# EAGLE design HCM6352 v10 (EAGLE 6.2)
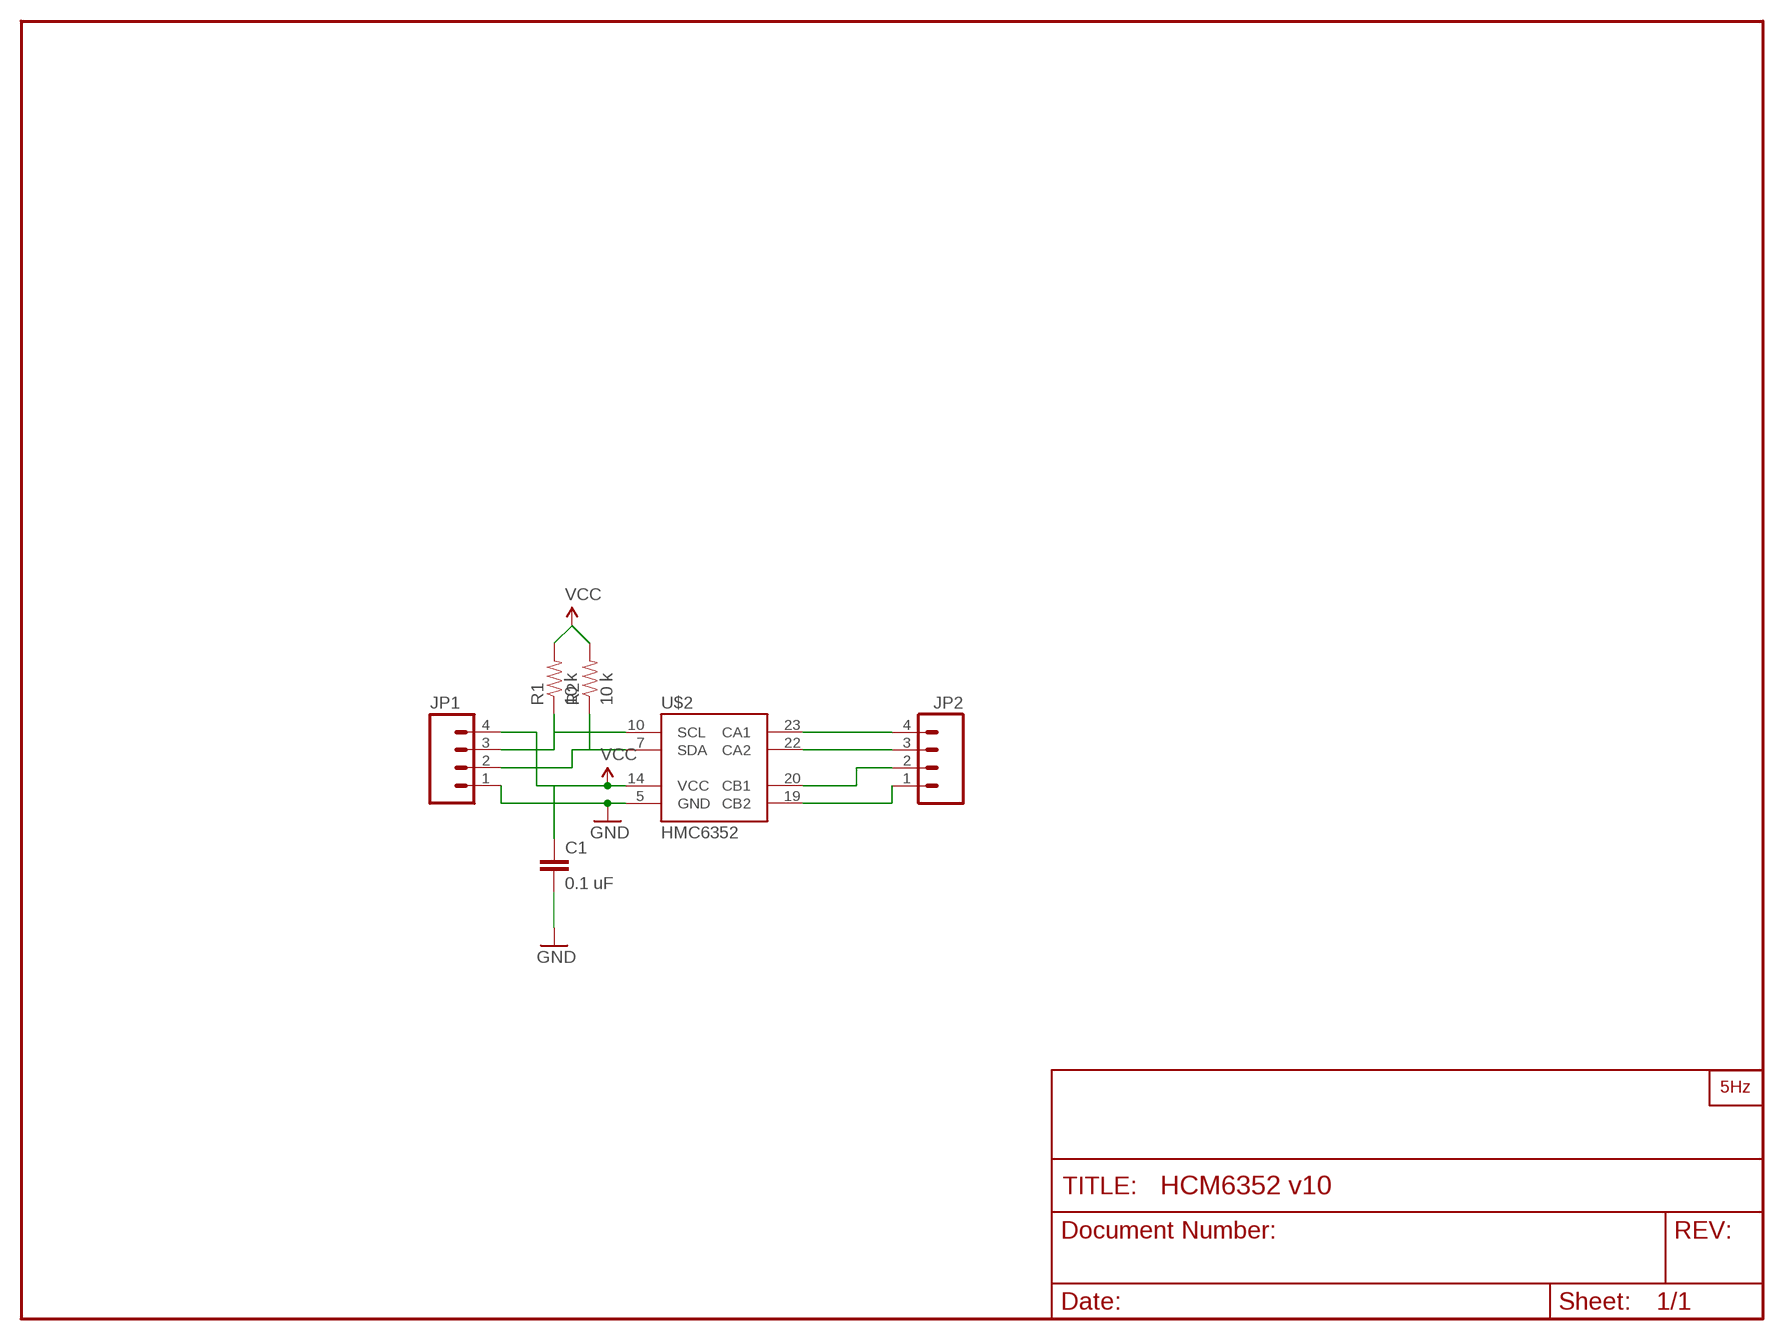
[diagram p0: schematic, sheet 1]

## Parts
C1  0.1 uF  CAP0603-CAP  [0603-CAP]
JP1  M04PTH  [1X04]
JP2  M04PTH  [1X04]
R1  10 k  RESISTOR0603-RES  [0603-RES]
R2  10 k  RESISTOR0603-RES  [0603-RES]
U$1  LOGO2_SILK5MM  [LOGO2_5MM]
U$2  HMC6352  [LCC24]

## Nets
GND: C1.2 JP1.1 U$2.5(GND)
N$1: JP1.3 R1.1 U$2.10(SCL)
N$2: JP1.2 R2.1 U$2.7(SDA)
N$5: JP2.4 U$2.23(CA1)
N$6: JP2.3 U$2.22(CA2)
N$7: JP2.2 U$2.20(CB1)
N$8: JP2.1 U$2.19(CB2)
VCC: C1.1 JP1.4 R1.2 R2.2 U$2.14(VCC)

## Library data of the parts
C1 = SparkFun:CAP: Capacitor Standard 0603 ceramic capacitor, and 0.1" leaded capacitor.
JP1 JP2 = SparkFun:M04: Header 4 Standard 4-pin 0.1" header. Use with straight break away headers (SKU : PRT-00116), right angle break away headers (PRT-00553), swiss pins (PRT-00743), machine pins (PRT-00117), and female headers (PRT-00115). Molex polarized connector foot print use with SKU : PRT-08231 with associated crimp pins and housings. 1MM SMD Version SKU: PRT-10208
R1 R2 = SparkFun:RESISTOR: Resistor Basic schematic elements and footprints for 0603, 1206, and PTH resistors.
U$1 = LOGO:LOGO2_SILK: PRINCIPAL
U$2 = SparkFun:HMC6352: HMC6352 This is the compass module from Honeywell. Works very well. Schematic and footprint are production proven. Spark Fun Electronics SKU : COM-07892

## Board
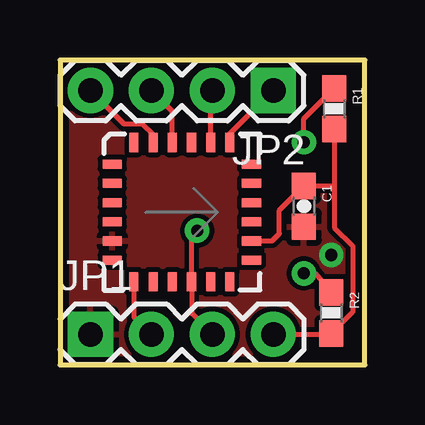
[diagram p1: board, top side]
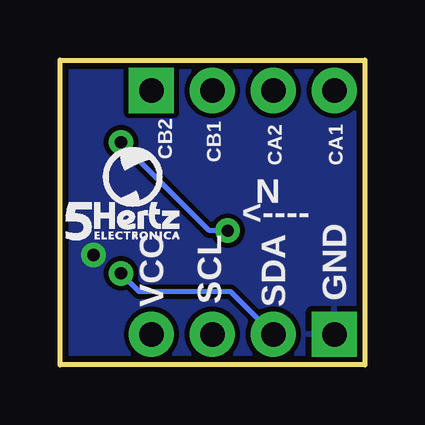
[diagram p2: board, bottom side, seen from below]

Size 12.7 x 12.7 mm. Coordinates in mm from the lower left corner, seen from the top.
Outline: 0,0 12.7,0 12.7,12.7 0,12.7 0,0
Copper layers (1*16): Top 0.035mm / dielectric 1.5mm / Bottom 0.035mm
Design rules: minimum track width 8mil, minimum drill 20mil, track to track 8mil, track to pad 8mil, pad to pad 8mil, via to via 8mil, smd to smd 8mil, copper to edge 10mil, drill to drill 8mil, minimum pad ring 12mil, minimum via ring 10mil, stop-mask expansion 4mil, vias tented up to drill 25mil, thermal gap 10mil

### Footprints (pad centres in the part's own frame; a part is rotated, then mirrored left to right if it is on the bottom)
0603-CAP = smd 1.1 x 1: 1 -0.85,0; 2 0.85,0
1X04 = drill 1.016 pad 1.88 square: 1 0,0 | drill 1.016 pad 1.88: 2 2.54,0; 3 5.08,0; 4 7.62,0
0603-RES = smd 1.1 x 1: 1 -0.85,0; 2 0.85,0
LCC24 = smd 0.8 x 0.38: 1 -2.9,2.01; 2 -2.9,1.21; 3 -2.9,0.41; 4 -2.9,-0.39; 5 -2.9,-1.19; 6 -2.9,-1.99; 13 2.9,-1.99; 14 2.9,-1.19; 15 2.9,-0.39; 16 2.9,0.41; 17 2.9,1.21; 18 2.9,2.01 | smd 0.38 x 0.8: 7 -2,-2.89; 8 -1.2,-2.89; 9 -0.4,-2.89; 10 0.4,-2.89; 11 1.2,-2.89; 12 2,-2.89; 19 2,2.91; 20 1.2,2.91; 21 0.4,2.91; 22 -0.4,2.91; 23 -1.2,2.91; 24 -2,2.91

### Placement (x,y rotation side)
C1  10.16,6.6 270 top
JP1  1.27,1.27 0 top
JP2  8.89,11.43 180 top
R1  11.43,10.67 270 top
R2  11.3,2.16 270 top
U$1  12.45,5.21 0 bottom
U$2  5.08,6.35 0 top

### Tracks (layer width: path | path; a pad name or v marks a point on that pad's centre or on a via)
GND  (via drill 0.51)
  other vias: 11.3,4.57
  pour Top: 0,12.7 12.7,12.7 12.7,0 0,0
  pour Bottom: 0,12.7 12.7,12.7 12.7,0 0,0
N$1  (via drill 0.51)
  Top 0.203: JP1.3 5.48,2.14 U$2.10 5.48,5.35 v5.71,5.59 | v10.16,9.27 10.16,10.25 R1.1
  Bottom 0.203: v5.71,5.59 6.48,5.59 v10.16,9.27
N$2  (via drill 0.51)
  Top 0.203: U$2.7 3.08,2 JP1.2 | 11.26,3.17 R2.1 10.63,3.81 v10.16,3.81
  Bottom 0.203: JP1.2 5.59,3.05 9.4,3.05 v10.16,3.81
N$5
  Top 0.203: U$2.23 3.88,9.58 3.43,10.03 2.67,10.03 JP2.4
N$6
  Top 0.203: U$2.22 4.68,10.56 JP2.3
N$7
  Top 0.203: U$2.20 6.28,11.36 JP2.2
N$8
  Top 0.203: U$2.19 7.08,9.62 JP2.1
VCC
  Top 0.203: JP1.4 11.39,1.27 R2.2 12.19,2.2 12.19,4.95 11.43,5.71 11.43,7.24 | R1.2 11.43,7.24 | 11.43,7.24 11.39,7.45 C1.1 9.14,6.44 9.14,5.46 8.84,5.16 U$2.14

### Text on the board
bPlace: CA1 | CA2 | CB1 | CB2 | N | ----> | GND | SCL | SDA | VCC